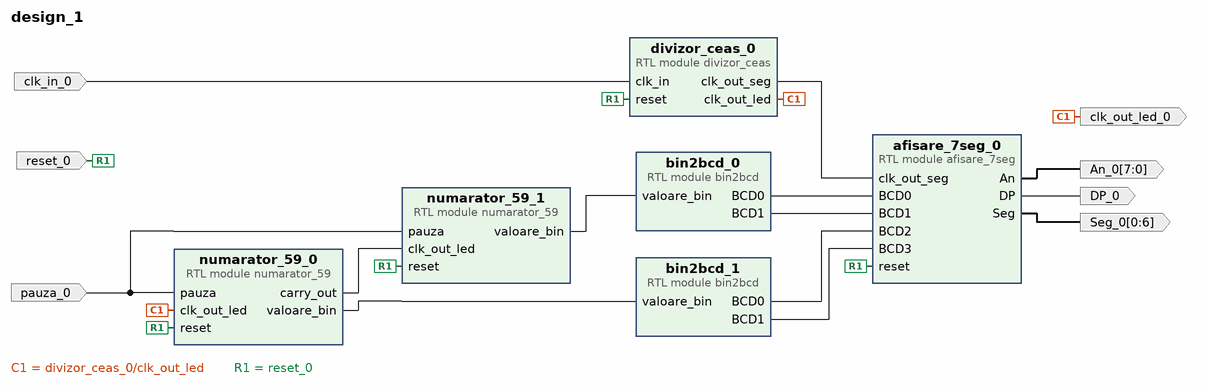
[diagram p0: block diagram of the top level]
# Vivado block design design_1, xc7a100tcsg324-1, Vivado 2021.2
create_bd_design design_1

create_bd_port -dir I -type rst reset_0
create_bd_port -dir I pauza_0
create_bd_port -dir I clk_in_0
create_bd_port -dir O clk_out_led_0
create_bd_port -dir O -from 7 -to 0 An_0
create_bd_port -dir O DP_0
create_bd_port -dir O -from 0 -to 6 Seg_0

create_bd_cell -type module -reference divizor_ceas divizor_ceas_0
create_bd_cell -type module -reference bin2bcd bin2bcd_0
create_bd_cell -type module -reference bin2bcd bin2bcd_1
create_bd_cell -type module -reference afisare_7seg afisare_7seg_0
create_bd_cell -type module -reference numarator_59 numarator_59_0
create_bd_cell -type module -reference numarator_59 numarator_59_1

# ---- connections ----

connect_bd_net [get_bd_pins afisare_7seg_0/An] [get_bd_ports An_0]
connect_bd_net [get_bd_pins afisare_7seg_0/DP] [get_bd_ports DP_0]
connect_bd_net [get_bd_pins afisare_7seg_0/Seg] [get_bd_ports Seg_0]
connect_bd_net [get_bd_pins bin2bcd_0/BCD0] [get_bd_pins afisare_7seg_0/BCD0]
connect_bd_net [get_bd_pins bin2bcd_0/BCD1] [get_bd_pins afisare_7seg_0/BCD1]
connect_bd_net [get_bd_pins bin2bcd_1/BCD0] [get_bd_pins afisare_7seg_0/BCD2]
connect_bd_net [get_bd_pins bin2bcd_1/BCD1] [get_bd_pins afisare_7seg_0/BCD3]
connect_bd_net -net clk_in_0_1 [get_bd_ports clk_in_0] [get_bd_pins divizor_ceas_0/clk_in]
connect_bd_net [get_bd_pins divizor_ceas_0/clk_out_led] [get_bd_ports clk_out_led_0] [get_bd_pins numarator_59_0/clk_out_led]
connect_bd_net [get_bd_pins divizor_ceas_0/clk_out_seg] [get_bd_pins afisare_7seg_0/clk_out_seg]
connect_bd_net -net numarator_59_0_bin_value [get_bd_pins numarator_59_0/valoare_bin] [get_bd_pins bin2bcd_1/valoare_bin]
connect_bd_net [get_bd_pins numarator_59_0/carry_out] [get_bd_pins numarator_59_1/clk_out_led]
connect_bd_net -net numarator_59_1_bin_value [get_bd_pins numarator_59_1/valoare_bin] [get_bd_pins bin2bcd_0/valoare_bin]
connect_bd_net -net pauza_0_1 [get_bd_ports pauza_0] [get_bd_pins numarator_59_0/pauza] [get_bd_pins numarator_59_1/pauza]
connect_bd_net -net reset_0_1 [get_bd_ports reset_0] \
  [get_bd_pins divizor_ceas_0/reset] [get_bd_pins afisare_7seg_0/reset] [get_bd_pins numarator_59_0/reset] \
  [get_bd_pins numarator_59_1/reset]

validate_bd_design
save_bd_design
